# Altium project ESP32_garage_door.PrjPcb
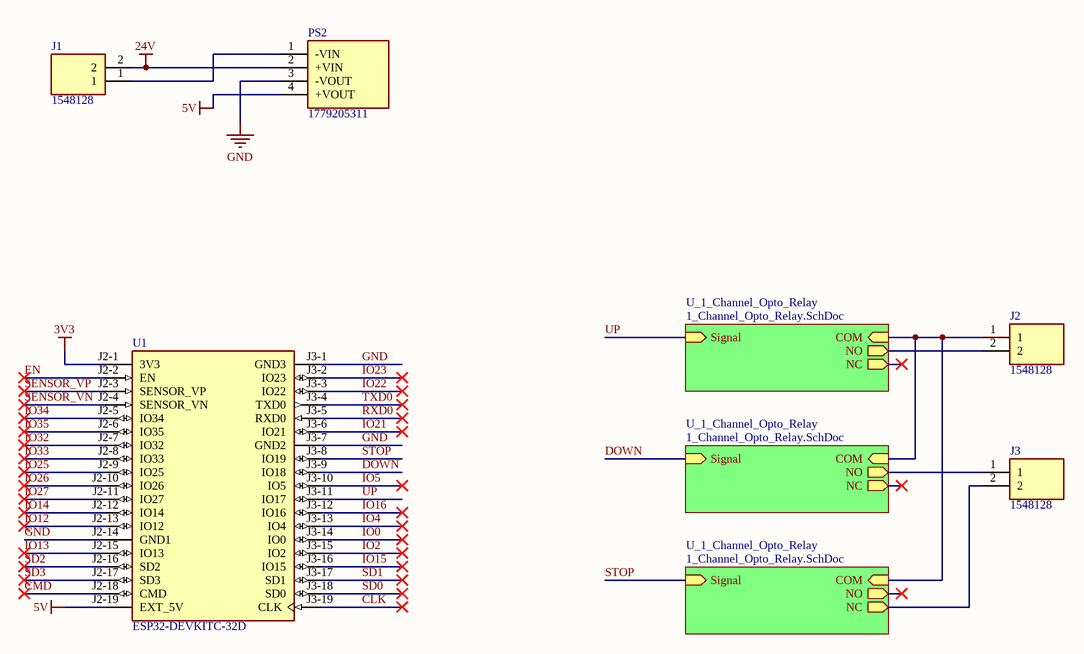
[diagram p0: ESP32_garage_door.SchDoc]
2 sheets, 26 parts. Net scope: hierarchical (ports join the sheet entries above them; power ports are global).
Board file: ESP32_garage_door PCB V1_1.PcbDoc
Sheets:
  ESP32_garage_door.SchDoc
    U_1_Channel_Opto_Relay = 1_Channel_Opto_Relay.SchDoc
    U_1_Channel_Opto_Relay = 1_Channel_Opto_Relay.SchDoc
    U_1_Channel_Opto_Relay = 1_Channel_Opto_Relay.SchDoc

## Sheet ESP32_garage_door.SchDoc
size A4; SheetNumber: 1; SheetTotal: 2

### Parts
J1  1548128  [1548128]
J2  1548128  [1548128]
J3  1548128  [1548128]
PS2  1779205311  [1779205311]
U1  ESP32-DEVKITC-32D  [MODULE_ESP32-DEVKITC-32D]

### Sub-sheets
U_1_Channel_Opto_Relay = 1_Channel_Opto_Relay.SchDoc: Signal (in), COM (in), NO (out), NC (out)
U_1_Channel_Opto_Relay = 1_Channel_Opto_Relay.SchDoc: Signal (in), COM (in), NO (out), NC (out)
U_1_Channel_Opto_Relay = 1_Channel_Opto_Relay.SchDoc: Signal (in), COM (in), NO (out), NC (out)

### Nets
3V3: U1.J2-1(3V3)
5V: PS2.4(+VOUT) U1.J2-19(EXT_5V)
24V: J1.2 PS2.2(+VIN)
GND: PS2.3(-VOUT) U1.J2-14(GND1) U1.J3-1(GND3) U1.J3-7(GND2)
CLK: U1.J3-19(CLK)
CMD: U1.J2-18(CMD)
DOWN: U1.J3-9(IO18) ; sheet U_1_Channel_Opto_Relay/Signal
EN: U1.J2-2(EN)
IO0: U1.J3-14(IO0)
IO2: U1.J3-15(IO2)
IO4: U1.J3-13(IO4)
IO5: U1.J3-10(IO5)
IO12: U1.J2-13(IO12)
IO13: U1.J2-15(IO13)
IO14: U1.J2-12(IO14)
IO15: U1.J3-16(IO15)
IO16: U1.J3-12(IO16)
IO21: U1.J3-6(IO21)
IO22: U1.J3-3(IO22)
IO23: U1.J3-2(IO23)
IO25: U1.J2-9(IO25)
IO26: U1.J2-10(IO26)
IO27: U1.J2-11(IO27)
IO32: U1.J2-7(IO32)
IO33: U1.J2-8(IO33)
IO34: U1.J2-5(IO34)
IO35: U1.J2-6(IO35)
RXD0: U1.J3-5(RXD0)
SD0: U1.J3-18(SD0)
SD1: U1.J3-17(SD1)
SD2: U1.J2-16(SD2)
SD3: U1.J2-17(SD3)
SENSOR_VN: U1.J2-4(SENSOR_VN)
SENSOR_VP: U1.J2-3(SENSOR_VP)
STOP: U1.J3-8(IO19) ; sheet U_1_Channel_Opto_Relay/Signal
TXD0: U1.J3-4(TXD0)
UP: U1.J3-11(IO17) ; sheet U_1_Channel_Opto_Relay/Signal
NetJ1_1: J1.1 PS2.1(-VIN)
NetJ2_1: J2.1 ; sheet U_1_Channel_Opto_Relay/COM, sheet U_1_Channel_Opto_Relay/COM, sheet U_1_Channel_Opto_Relay/COM
NetJ2_2: J2.2 ; sheet U_1_Channel_Opto_Relay/NO
NetJ3_1: J3.1 ; sheet U_1_Channel_Opto_Relay/NO
NetJ3_2: J3.2 ; sheet U_1_Channel_Opto_Relay/NC

### Library data of the parts
J1-J3 = 1548128: Connector; Manufacturer_Name: Phoenix Contact; Datasheet Link: https://product-download.phoenixcontact.com/8064728?response-content-disposition=inline;%20filename%3D%22pxc_1548128_00_05_MKDSN-1-5-2-5-08-SPE_FAM.pdf%22&Expires=1710663383&Signature=dNE3xUpP8aZKNM7MbijW96iZv~1ZSU7z-jr1GpV8auc4knETZVFd79aWCcONAeV4hWLRa32; Height: 10.15mm; Manufacturer_Part_Number: 1548128; Mouser Part Number: 651-1548128; Mouser Price/Stock: https://www.mouser.co.uk/ProductDetail/Phoenix-Contact/1548128?qs=ulEaXIWI0c87QOzP9yohxA%3D%3D
PS2 = 1779205311: Power Supply; Manufacturer_Name: Wurth Elektronik; Datasheet Link: https://www.we-online.com/components/products/datasheet/1779205311.pdf; Height: 10.41mm; Manufacturer_Part_Number: 1779205311
U1 = CMP-005-000000-1: WiFi Development Tools (802.11) ESP32 General Development Kit, ESP32-WROOM-32D on the board; MF: Espressif Systems; Pin Count: 38; Source: ESP32-DEVKITC-32D.SchLib; Check_prices: https://www.snapeda.com/parts/ESP32-DEVKITC-32D/Espressif+Systems/view-part/?ref=eda; Value: *; Package: None; Design Item ID: ESP32-DEVKITC-32D; Component Type: Standard; MP: ESP32-DEVKITC-32D; SnapEDA_Link: https://www.snapeda.com/parts/ESP32-DEVKITC-32D/Espressif+Systems/view-part/?ref=snap

## Sheet 1_Channel_Opto_Relay.SchDoc
size A4; SheetNumber: 2; SheetTotal: 2
Used 3 times, as channels U_1_Channel_Opto_Relay, U_1_Channel_Opto_Relay, U_1_Channel_Opto_Relay. Parts and nets are listed once, with the designators drawn on the sheet.
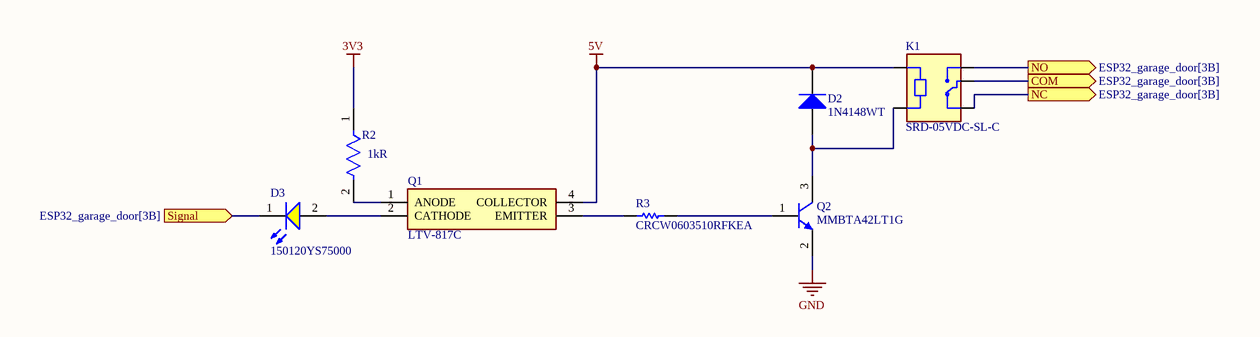
[diagram p1: 1_Channel_Opto_Relay.SchDoc]

### Parts
D2  1N4148WT  [FAIR-SOD-523F-2_V]
D3  150120YS75000  [WL-SMCW_1206_150120xx75000]
K1  SRD-05VDC-SL-C  [RELAY_SRD-05VDC-SL-C]
Q1  LTV-817C  [DIP762W60P254L460H450Q4N]
Q2  MMBTA42LT1G  [ONSC-SOT-23-3-318-08_V]
R2  Resistance: 1kR  [FP-AC0603-IPC_B]  (hidden comment: AC0603FR-071KL)
R3  CRCW0603510RFKEA  [RESC1609X50X30NL10T20]

### Ports
COM (out, see ESP32_garage_door[3B]), NC (out, see ESP32_garage_door[3B]), NO (out, see ESP32_garage_door[3B]), Signal (in, see ESP32_garage_door[3B])

### Nets
3V3: R2.1
5V: D2.1(K) K1.A1 Q1.4(COLLECTOR)
GND: Q2.2(E)
COM: K1.COM ; port COM
NC: K1.NC ; port NC
NO: K1.NO ; port NO
Signal: D3.1(K) ; port Signal
NetD2_2: D2.2(A) K1.A2 Q2.3(C)
NetD3_2: D3.2(A) Q1.2(CATHODE)
NetQ1_1: Q1.1(ANODE) R2.2
NetQ1_3: Q1.3(EMITTER) R3.1
NetQ2_1: Q2.1(B) R3.2

### Channels
U_1_Channel_Opto_Relay: designators end in C; ports COM=NetJ2_1 NC=NetK1C_NC NO=NetJ2_2 Signal=UP
U_1_Channel_Opto_Relay: designators end in B; ports COM=NetJ2_1 NC=NetK1B_NC NO=NetJ3_1 Signal=DOWN
U_1_Channel_Opto_Relay: designators end in A; ports COM=NetJ2_1 NC=NetJ3_2 NO=NetK1A_NO Signal=STOP

### Library data of the parts
D2 = CMP-0881-00001-1: High Conductance Fast Switching Diode, 75 V, -55 to 150 degC, 2-Pin SOD523F, RoHS; Manufacturer: Fairchild Semiconductor; IR (VR: 75 V)=5 uA Max.; VF: 1 V Max.; BVR (IR: 5 uA)=75 V Min.; CO: 4 pF Max.; DatasheetVersion: Rev. A2; ComponentLink1Description: Manufacturer URL; PackageDescription: 2-Pin Surface Mount Device, Body 1.2 x 0.8 mm, Height 0.7 mm; ComponentLink2URL: http://www.fairchildsemi.com/ds/1N/1N4148WT.pdf; ComponentLink2Description: Datasheet; PartNumber: 1N4148WT; ComponentLink1URL: http://www.fairchildsemi.com/; Temperature Range: -55 to 150 degC; Mounting Technology: Surface Mount; PackageReference: SOD-523F-2; RoHS: TRUE
D3 = CMP-1426-00019-3: Led, Yellow, 590 Nm, 2 V, 30 Ma, 120 Mcd Rohs Compliant: Yes; Dominant Wavelength: 590nm; Forward Voltage: 2V; Forward Current: 100mA; Viewing Angle: 140°; Max Reverse Voltage (DC): 5V; Peak Wavelength: 595nm; Lens Style: Clear, Rectangular; Test Current: 20mA; Luminous Intensity: 120mcd; REACH SVHC: Unknown; Length: 3.2mm; RoHS: Compliant; Packaging: Tape and Reel; Min Operating Temperature: -40°C; Mount: Surface Mount; Max Operating Temperature: 85°C; Wavelength: 590nm; Case/Package: 1206; Case Code (Imperial): 1206; Color: Yellow; Height: 680µm; Case Code (Metric): 3216; Width: 1.6mm
K1 = CMP-003-000000-1: 5V Trigger Relay Module For Arduino And Raspberry Pi 5V Trigger Relay Module For Arduino And Raspberry Pi; MF: Songle Relay; Package: NON STANDARD-5 Songle Relay; Design Item ID: SRD-05VDC-SL-C; MP: SRD-05VDC-SL-C; Pin Count: 5; Price: None; Source: SRD-05VDC-SL-C.SchLib; Availability: Not in stock; Check_prices: https://www.snapeda.com/parts/SRD-05VDC-SL-C/Songle+Relay/view-part/?ref=eda; Value: *; Component Type: Standard; SnapEDA_Link: https://www.snapeda.com/parts/SRD-05VDC-SL-C/Songle+Relay/view-part/?ref=snap
Q1 = LTV-817C: Phototransistor; Manufacturer_Name: Lite-On; Datasheet Link: https://optoelectronics.liteon.com/upload/download/DS-70-96-0016/LTV-8X7%20series%20201610%20.pdf; Height: 4.5mm; Manufacturer_Part_Number: LTV-817C; Mouser Part Number: 859-LTV-817C; Mouser Price/Stock: https://www.mouser.co.uk/ProductDetail/Lite-On/LTV-817C?qs=WAWaI72GHKzVL8VAYU18sA%3D%3D; Arrow Part Number: LTV-817C; Arrow Price/Stock: https://www.arrow.com/en/products/ltv-817-c/lite-on-technology?utm_currency=USD&region=europe
Q2 = CMP-1048-00662-1: High Voltage Transistor, NPN Silicon, 3-Pin SOT-23, Pb-Free, Tape and Reel; Manufacturer: On Semiconductor; fT Min (MHz): 50; IC Continuous (A): 0.5; ComponentLink1URL: http://www.onsemi.com/; ComponentLink3URL: http://www.onsemi.cn/pub_link/Collateral/318-08.PDF; RoHS: TRUE; ComponentLink2Description: Datasheet; PartNumber: MMBTA42LT1G; Polarity: NPN; DatasheetVersion: Rev. 12; PackageReference: SOT-23-3-318-08; PackageDescription: 3-Pin Small Outline Transistor, Body 2.92 x 1.3 mm, Pitch 0.95 mm; ComponentLink3Description: Package Specification; ComponentLink1Description: Manufacturer URL; Packing: Tape and Reel; PackageVersion: Rev. AP, 11/2009; Mounting Technology: Surface Mount; ComponentLink2URL: http://www.onsemi.cn/pub_link/Collateral/MMBTA42LT1-D.PDF
R2 = CMP-2000-04828-3: RES 1kΩ 1.00% 0.1W 0603; Voltage Rating: 50V; Power Rating: 100mW; Tolerance: 1%; Temperature Coefficient: 100ppm/°C; Depth: 0.8mm; Case/Package: 0603; Size Code: 0603; Case Code (Metric): 1608; Height: 0.022inch; Series: AC; Width: 0.031inch; Construction: Rectangular; Length: 0.063inch; Case Code (Imperial): 0603; Package Quantity: 1; RoHS Compliant: Yes; Features: Moisture Resistant; Resistor Type: Thick Film; Max Power Dissipation: 100mW; Packaging: Tape and Reel; Termination: SMD/SMT; Ratings: AEC-Q200; Max Operating Temperature: 155°C; Min Operating Temperature: -55°C; Military Standard: Not; Lead Free: Lead Free; Number of Terminations: 2
R3 = CMP-2000-03439-1: Manufacturer: Vishay Dale; Part Number: CRCW0603510RFKEA

## Nets that join several sheets
3V3: ESP32_garage_door (U1.J2-1), U_1_Channel_Opto_Relay (R2C.1), U_1_Channel_Opto_Relay (R2B.1), U_1_Channel_Opto_Relay (R2A.1)
5V: ESP32_garage_door (PS2.4 U1.J2-19), U_1_Channel_Opto_Relay (D2C.1 K1C.A1 Q1C.4), U_1_Channel_Opto_Relay (D2B.1 K1B.A1 Q1B.4), U_1_Channel_Opto_Relay (D2A.1 K1A.A1 Q1A.4)
GND: ESP32_garage_door (PS2.3 U1.J2-14 U1.J3-1 U1.J3-7), U_1_Channel_Opto_Relay (Q2C.2), U_1_Channel_Opto_Relay (Q2B.2), U_1_Channel_Opto_Relay (Q2A.2)
DOWN: ESP32_garage_door (U1.J3-9), U_1_Channel_Opto_Relay (D3B.1)
NetJ2_1: ESP32_garage_door (J2.1), U_1_Channel_Opto_Relay (K1C.COM), U_1_Channel_Opto_Relay (K1B.COM), U_1_Channel_Opto_Relay (K1A.COM)
NetJ2_2: ESP32_garage_door (J2.2), U_1_Channel_Opto_Relay (K1C.NO)
NetJ3_1: ESP32_garage_door (J3.1), U_1_Channel_Opto_Relay (K1B.NO)
NetJ3_2: ESP32_garage_door (J3.2), U_1_Channel_Opto_Relay (K1A.NC)
STOP: ESP32_garage_door (U1.J3-8), U_1_Channel_Opto_Relay (D3A.1)
UP: ESP32_garage_door (U1.J3-11), U_1_Channel_Opto_Relay (D3C.1)